# EasyEDA schematic Prática-05-2.json
TITLE: Sheet_1; REV: 1.0; Date: 2020-09-23; Sheet: 1/1; Company: Your Company
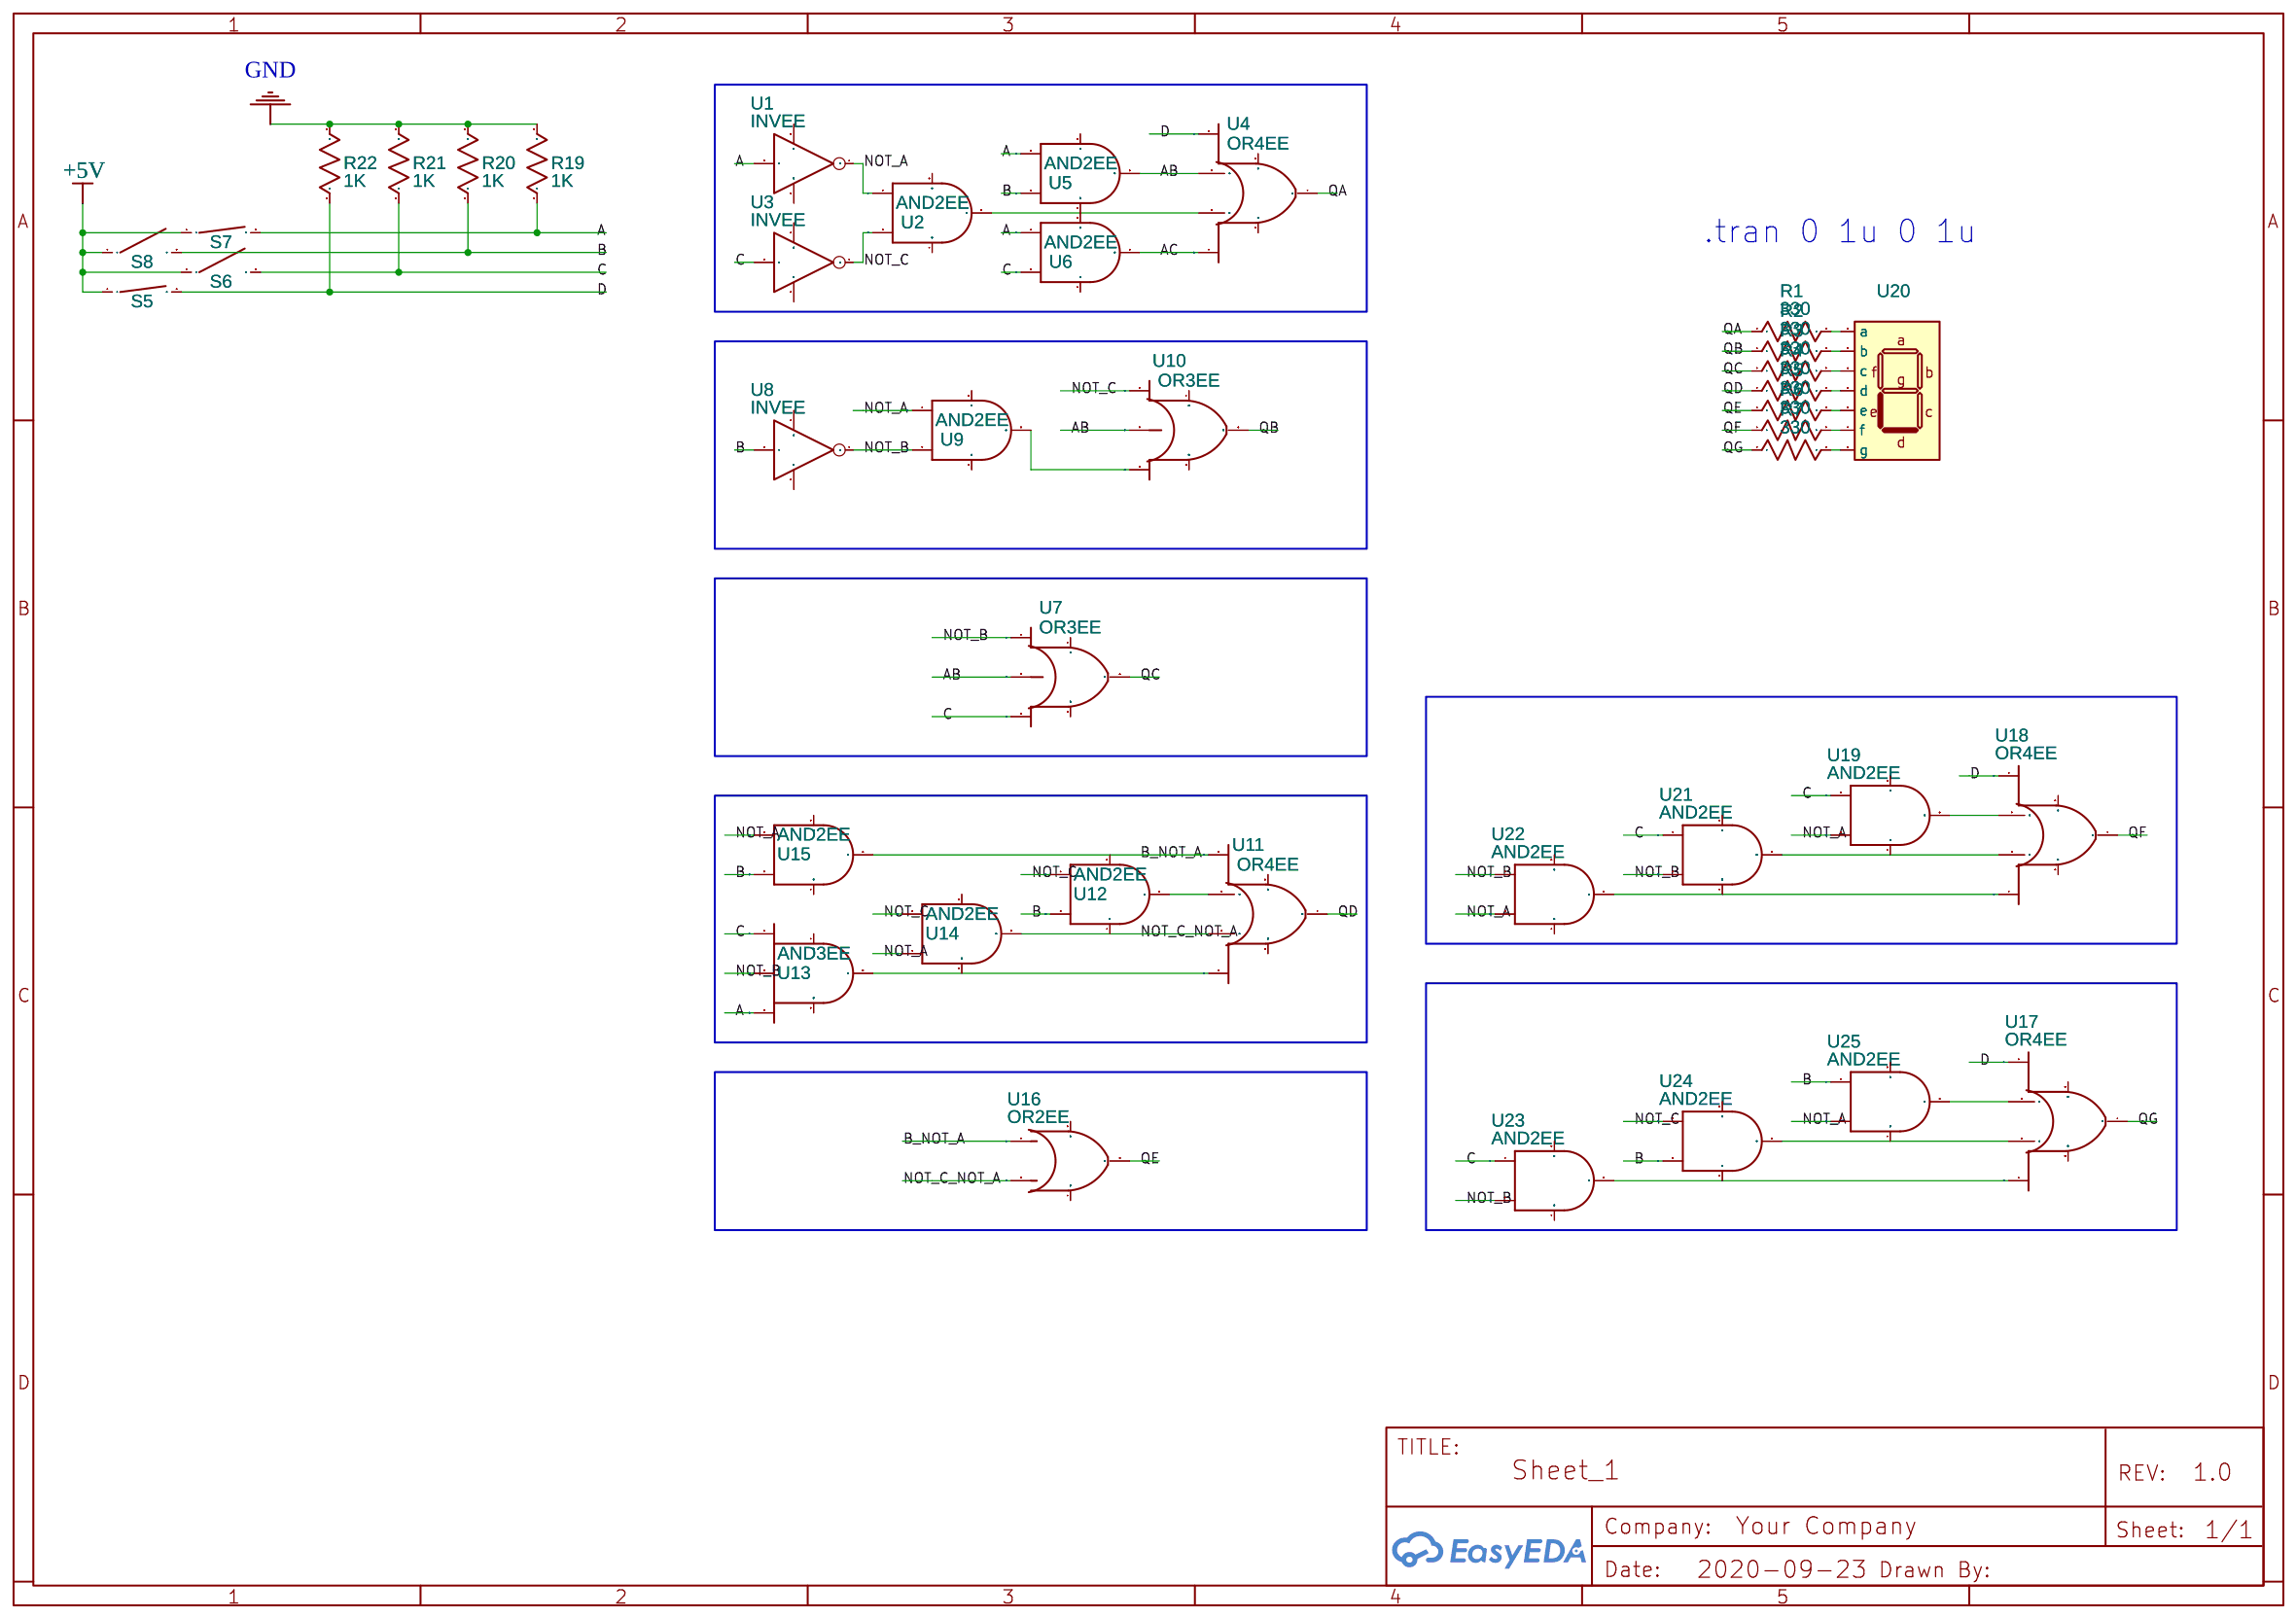
[diagram p0: schematic sheet]

## Parts
R1  330  [AXIAL-0.3]
R2  330  [AXIAL-0.3]
R3  330  [AXIAL-0.3]
R4  330  [AXIAL-0.3]
R5  330  [AXIAL-0.3]
R6  330  [AXIAL-0.3]
R7  330  [AXIAL-0.3]
R19  1K  [AXIAL-0.3]
R20  1K  [AXIAL-0.3]
R21  1K  [AXIAL-0.3]
R22  1K  [AXIAL-0.3]
S5  SPST_Open
S6  SPST_Open
S7  SPST_Open
S8  SPST_Open
U1  INVEE
U2  AND2EE
U3  INVEE
U4  OR4EE
U5  AND2EE
U6  AND2EE
U7  OR3EE
U8  INVEE
U9  AND2EE
U10  OR3EE
U11  OR4EE
U12  AND2EE
U13  AND3EE
U14  AND2EE
U15  AND2EE
U16  OR2EE
U17  OR4EE
U18  OR4EE
U19  AND2EE
U20  Seven_Segment
U21  AND2EE
U22  AND2EE
U23  AND2EE
U24  AND2EE
U25  AND2EE

## Library data of the parts
R1-R7 R19-R22 = Resistor_US: Resistance: 1k; Contributor: EasyEDA; Supplier: YUJING
S5 S7 = SPST: catid: 20; State: Close; Contributor: EasyEDA; NameDisplay: 0
S6 S8 = SPST: catid: 20; State: Open; Contributor: EasyEDA; NameDisplay: 0
U1-U19 U21-U25 = LOGIC: Contributor: EasyEDA
U20 = SEVENSEGMENT: catid: 20; Type: Common Cathode; Color: Red; Contributor: EasyEDA; NameDisplay: 0

## Nets
+5V: S5.1 S6.1 S7.1 S8.1
GND: R19.2 R20.2 R21.2 R22.2
A: R19.1 S7.2 U1.1(IN) U5.1(INA) U6.1(INA) U13.3(INC)
AB: U4.2(INB) U5.5(OUT) U7.2(INB) U10.2(INB)
AC: U4.4(IND) U6.5(OUT)
B: R20.1 S8.2 U5.2(INB) U8.1(IN) U12.2(INB) U15.2(INB) U24.2(INB) U25.1(INA)
B_NOT_A: U11.1(INA) U15.5(OUT) U16.1(INA)
C: R21.1 S6.2 U3.1(IN) U6.2(INB) U7.3(INC) U13.1(INA) U19.1(INA) U21.1(INA) U23.1(INA)
D: R22.1 S5.2 U4.1(INA) U17.1(INA) U18.1(INA)
NOT_A: U1.4(OUT) U2.1(INA) U9.1(INA) U14.2(INB) U15.1(INA) U19.2(INB) U22.2(INB) U25.2(INB)
NOT_B: U7.1(INA) U8.4(OUT) U9.2(INB) U13.2(INB) U21.2(INB) U22.1(INA) U23.2(INB)
NOT_C: U2.2(INB) U3.4(OUT) U10.1(INA) U12.1(INA) U14.1(INA) U24.1(INA)
NOT_C_NOT_A: U11.3(INC) U14.5(OUT) U16.2(INB)
QA: R1.1 U4.7(OUT)
QB: R2.1 U10.6(OUT)
QC: R3.1 U7.6(OUT)
QD: R4.1 U11.7(OUT)
QE: R5.1 U16.5(OUT)
QF: R6.1 U18.7(OUT)
QG: R7.1 U17.7(OUT)
Net-(R1-2): R1.2 U20.a
Net-(R2-2): R2.2 U20.b
Net-(R3-2): R3.2 U20.c
Net-(R4-2): R4.2 U20.d
Net-(R5-2): R5.2 U20.e
Net-(R6-2): R6.2 U20.f
Net-(R7-2): R7.2 U20.g
Net-(U2-5): U2.5(OUT) U4.3(INC)
Net-(U5-4): U5.4(GND) U6.3(VDD)
Net-(U9-5): U9.5(OUT) U10.3(INC)
Net-(U11-2): U11.2(INB) U12.5(OUT)
Net-(U11-4): U11.4(IND) U13.6(OUT)
Net-(U17-2): U17.2(INB) U25.5(OUT)
Net-(U17-3): U17.3(INC) U24.5(OUT)
Net-(U17-4): U17.4(IND) U23.5(OUT)
Net-(U18-2): U18.2(INB) U19.5(OUT)
Net-(U18-3): U18.3(INC) U21.5(OUT)
Net-(U18-4): U18.4(IND) U22.5(OUT)

Not connected (* = marked no-connect by the designer): U1 2(VDD) 3(GND); U2 3(VDD) 4(GND); U3 2(VDD) 3(GND); U4 5(VDD) 6(GND); U5 3(VDD); U6 4(GND); U7 4(VDD) 5(GND); U8 2(VDD) 3(GND); U9 3(VDD) 4(GND); U10 4(VDD) 5(GND); U11 5(VDD) 6(GND); U12 3(VDD) 4(GND); U13 4(VDD) 5(GND); U14 3(VDD) 4(GND); U15 3(VDD) 4(GND); U16 3(VDD) 4(GND); U17 5(VDD) 6(GND); U18 5(VDD) 6(GND); U19 3(VDD) 4(GND); U21 3(VDD) 4(GND); U22 3(VDD) 4(GND); U23 3(VDD) 4(GND); U24 3(VDD) 4(GND); U25 3(VDD) 4(GND)

## Notes on the sheet
- .tran 0 1u 0 1u
